# Altium schematic sheet ZET6_原理图.SchDoc
size A3; SheetNumber: 1; SheetTotal: 1
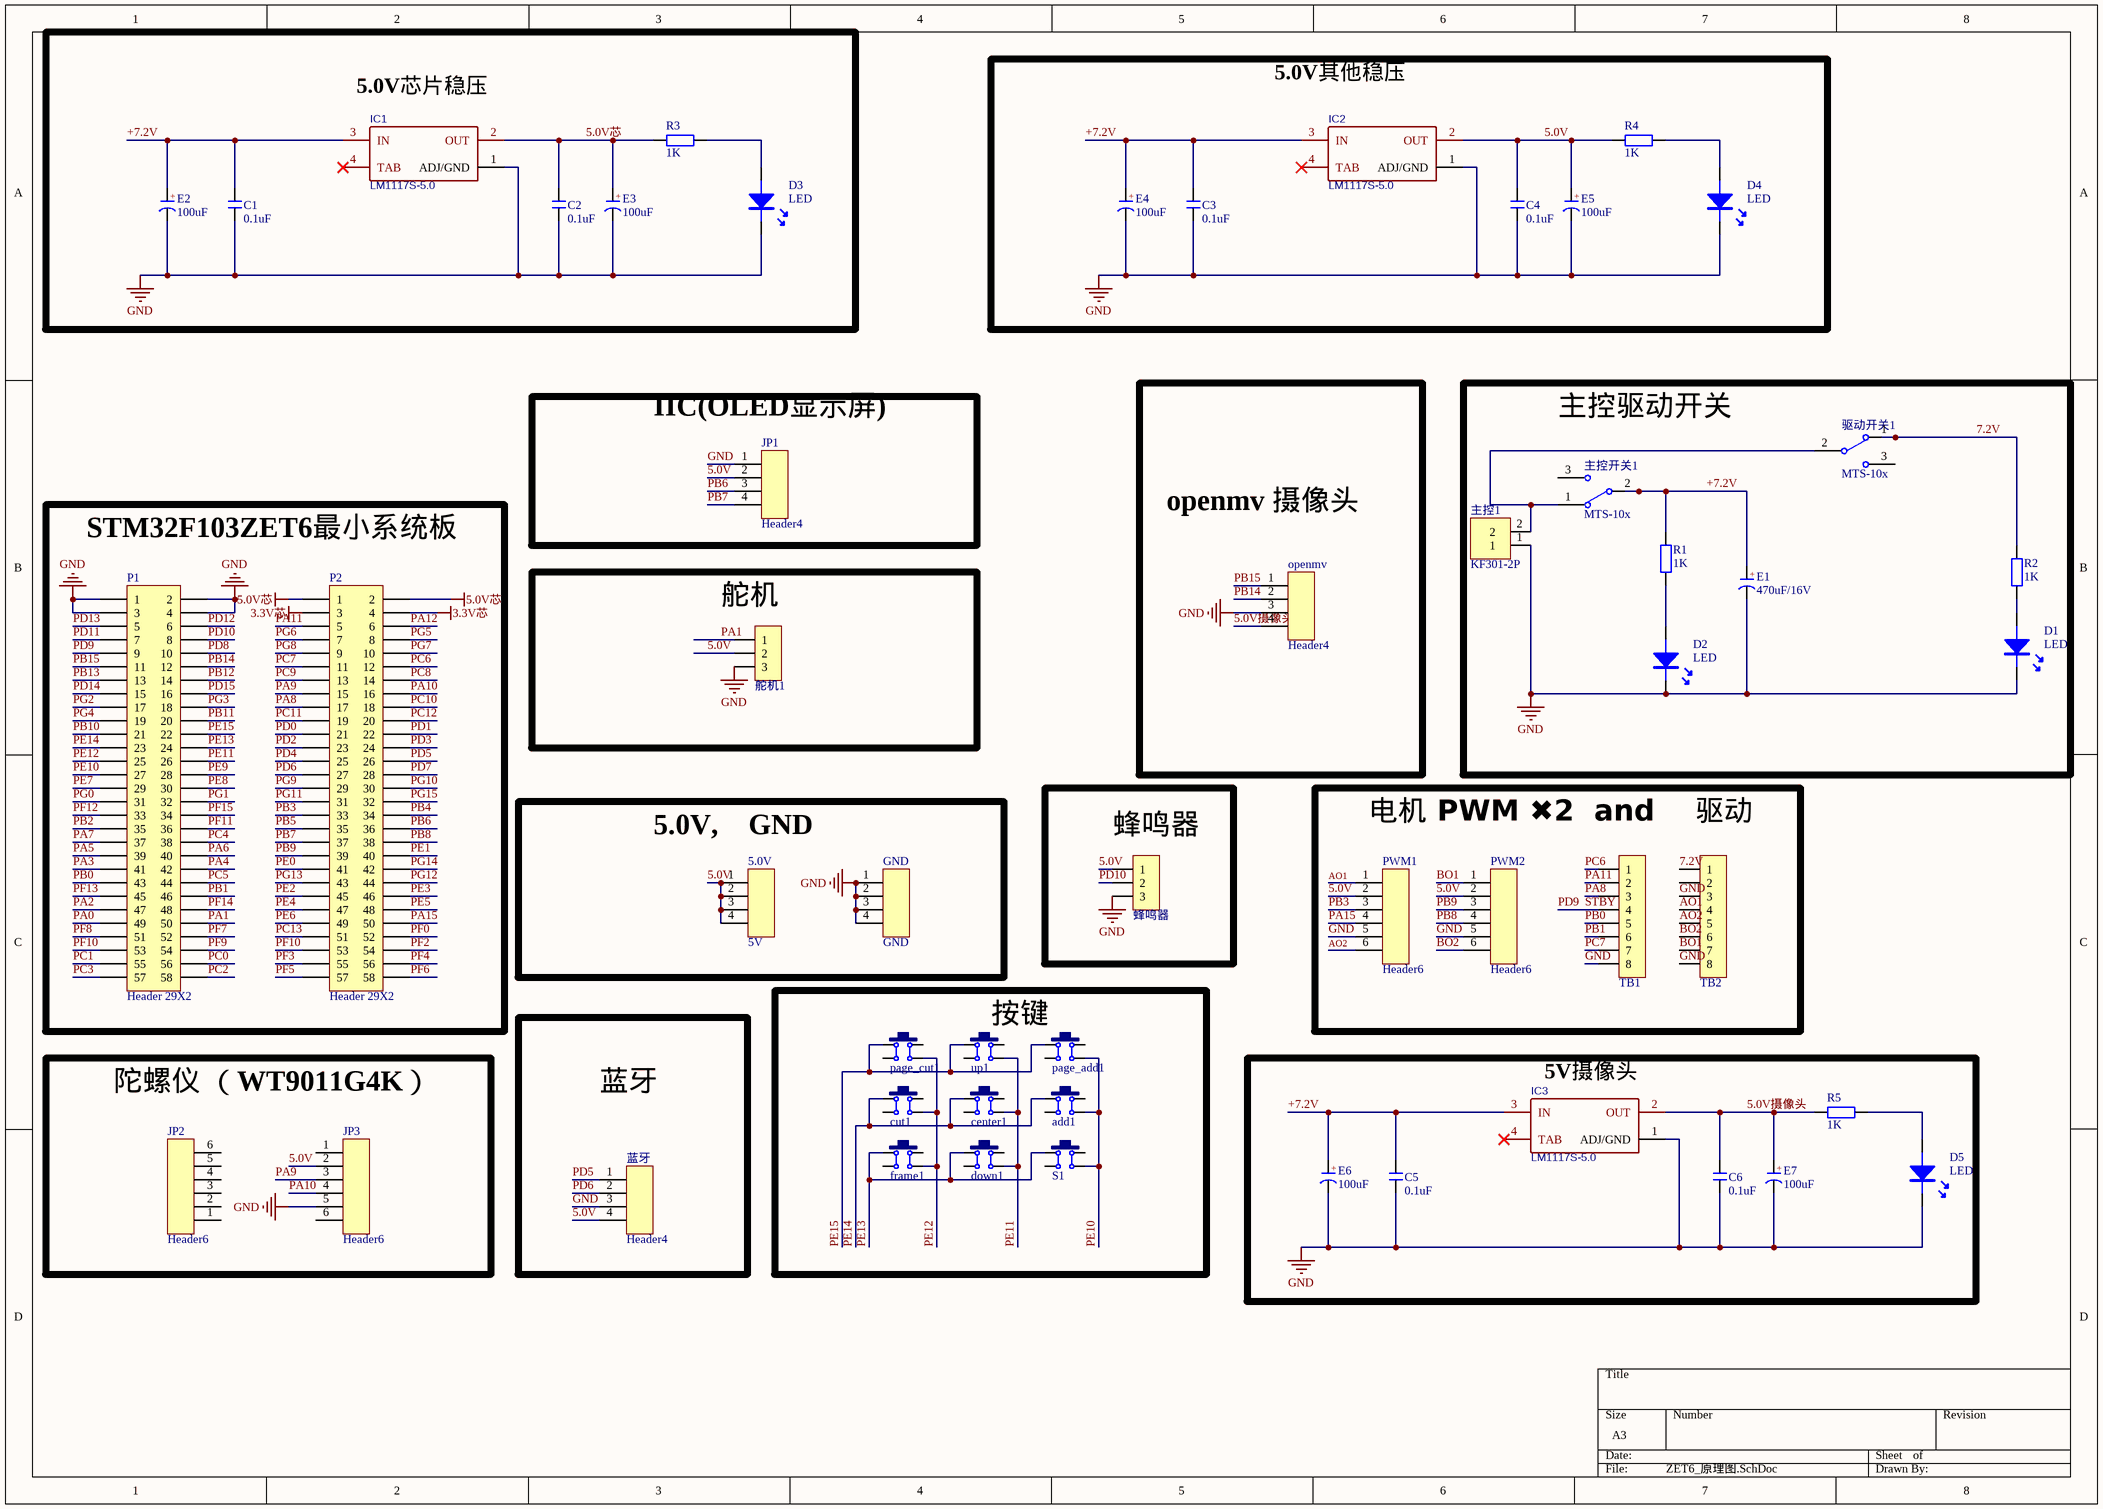
[diagram p0: ZET6_原理图.SchDoc]

## Parts
5.0V  5V  [JP4]
add1  6x6x5  [TSW DIP-6*6*6]  (value not drawn)
C1  0.1uF  [C 0805_M]
C2  0.1uF  [C 0805_M]
C3  0.1uF  [C 0805_M]
C4  0.1uF  [C 0805_M]
C5  0.1uF  [C 0805_M]
C6  0.1uF  [C 0805_M]
center1  6x6x5  [TSW DIP-6*6*6]  (value not drawn)
cut1  6x6x5  [TSW DIP-6*6*6]  (value not drawn)
D1  LED  [LED-0805B]
D2  LED  [LED-0805B]
D3  LED  [LED-0805R]
D4  LED  [LED-0805R]
D5  LED  [LED-0805R]
down1  6x6x5  [TSW DIP-6*6*6]  (value not drawn)
E1  470uF/16V  [CAP 2.5*6.3*11.2 - BK]
E2  100uF  [CD A(3216)]
E3  100uF  [CD A(3216)]
E4  100uF  [CD A(3216)]
E5  100uF  [CD A(3216)]
E6  100uF  [CD A(3216)]
E7  100uF  [CD A(3216)]
frame1  6x6x5  [TSW DIP-6*6*6]  (value not drawn)
GND  GND  [JP4]
IC1  LM1117S-5.0  [SOT-223-3_L6.5-W3.4-P2.30-LS7.0-BR]
IC2  LM1117S-5.0  [SOT-223-3_L6.5-W3.4-P2.30-LS7.0-BR]
IC3  LM1117S-5.0  [SOT-223-3_L6.5-W3.4-P2.30-LS7.0-BR]
JP1  Header4  [JP4]
JP2  Header6  [JP6]
JP3  Header6  [JP6]
openmv  Header4  [JP4]
P1  Header 29X2  [HDR2X29]
P2  Header 29X2  [HDR2X29]
page_add1  6x6x5  [TSW DIP-6*6*6]  (value not drawn)
page_cut1  6x6x5  [TSW DIP-6*6*6]  (value not drawn)
PWM1  Header6  [JP6]
PWM2  Header6  [JP6]
R1  1K  [R 0805_M]
R2  1K  [R 0805_M]
R3  1K  [R 0805_L]
R4  1K  [R 0805_L]
R5  1K  [R 0805_L]
S1  6x6x5  [TSW DIP-6*6*6]  (value not drawn)
TB1  HDR-1X8  [JP8]  (value not drawn)
TB2  HDR-1X8  [JP8]  (value not drawn)
up1  6x6x5  [TSW DIP-6*6*6]  (value not drawn)
主控1  KF301-2P  [KF301-5.0-2P]
主控开关1  MTS-10x  [SS-12D10]
舵机1  HDR-1X3  [jp3]  (value not drawn)
蓝牙  Header4  [JP4]
蜂鸣器  HDR-1X3  [JP3]  (value not drawn)
驱动开关1  MTS-10x  [KFT DIP-7X7]

## Blocks framed on the sheet
5.0V芯片稳压: C1 C2 D3 E2 E3 IC1 R3
5.0V其他稳压: C3 C4 D4 E4 E5 IC2 R4
openmv 摄像头: openmv
主控驱动开关: D1 D2 E1 R1 R2 主控1 主控开关1 驱动开关1
IIC(OLED显示屏): JP1
STM32F103ZET6最小系统板: P1 P2
舵机: 舵机1
5.0V,    GND: 5.0V GND
蜂鸣器: 蜂鸣器
电机 PWM ✖2  and    驱动: PWM1 PWM2 TB1 TB2
按键: add1 center1 cut1 down1 frame1 page_add1 page_cut1 S1 up1
蓝牙: 蓝牙
陀螺仪 （WT9011G4K）: JP2 JP3
5V摄像头: C5 C6 D5 E6 E7 IC3 R5

## Nets
3.3V芯: P2.3 P2.4
5.0V芯: C2.2 E3.1(A) IC1.2(OUT) P2.1 P2.2 R3.1
GND: C1.1 C2.1 C3.1 C4.1 C5.1 C6.1 D1.K D2.K D3.K D4.K D5.K E1.2(K) E2.2(K) E3.2(K) E4.2(K) E5.2(K) E6.2(K) E7.2(K) GND.1 GND.2 GND.3 GND.4 IC1.1(ADJ/GND) IC2.1(ADJ/GND) IC3.1(ADJ/GND) JP1.1 JP3.5 openmv.3 P1.1 P1.2 P1.3 P1.4 PWM1.5 PWM2.5 TB1.8 TB2.3 TB2.8 主控1.1 舵机1.3 蓝牙.3 蜂鸣器.3
5.0V: 5.0V.1 5.0V.2 5.0V.3 5.0V.4 C4.2 E5.1(A) IC2.2(OUT) JP1.2 JP3.2 PWM1.2 PWM2.2 R4.1 舵机1.2 蓝牙.4 蜂鸣器.1
5.0V摄像头: C6.2 E7.1(A) IC3.2(OUT) openmv.4 R5.1
7.2V: R2.2 TB2.1 驱动开关1.1
+7.2V: C1.2 C3.2 C5.2 E1.1(A) E2.1(A) E4.1(A) E6.1(A) IC1.3(IN) IC2.3(IN) IC3.3(IN) R1.2 主控开关1.2
AO1: PWM1.1 TB2.4
AO2: PWM1.6 TB2.5
BO1: PWM2.1 TB2.7
BO2: PWM2.6 TB2.6
PA0: P1.49
PA1: P1.50 舵机1.1
PA2: P1.47
PA3: P1.41
PA4: P1.42
PA5: P1.39
PA6: P1.40
PA7: P1.37
PA8: P2.17 TB1.3
PA9: JP3.3 P2.15
PA10: JP3.4 P2.16
PA11: P2.5 TB1.2
PA12: P2.6
PA15: P2.50 PWM1.4
PB0: P1.43 TB1.5
PB1: P1.46 TB1.6
PB2: P1.35
PB3: P2.33 PWM1.3
PB4: P2.34
PB5: P2.35
PB6: JP1.3 P2.36
PB7: JP1.4 P2.37
PB8: P2.38 PWM2.4
PB9: P2.39 PWM2.3
PB10: P1.21
PB11: P1.20
PB12: P1.14
PB13: P1.13
PB14: openmv.2 P1.12
PB15: openmv.1 P1.11
PC0: P1.56
PC1: P1.55
PC2: P1.58
PC3: P1.57
PC4: P1.38
PC5: P1.44
PC6: P2.12 TB1.1
PC7: P2.11 TB1.7
PC8: P2.14
PC9: P2.13
PC10: P2.18
PC11: P2.19
PC12: P2.20
PC13: P2.51
PD0: P2.21
PD1: P2.22
PD2: P2.23
PD3: P2.24
PD4: P2.25
PD5: P2.26 蓝牙.1
PD6: P2.27 蓝牙.2
PD7: P2.28
PD8: P1.10
PD9: P1.9 TB1.4  [also labelled STBY]
PD10: P1.8 蜂鸣器.2
PD11: P1.7
PD12: P1.6
PD13: P1.5
PD14: P1.15
PD15: P1.16
PE0: P2.41
PE1: P2.40
PE2: P2.45
PE3: P2.46
PE4: P2.47
PE5: P2.48
PE6: P2.49
PE7: P1.29
PE8: P1.30
PE9: P1.28
PE10: add1.3 P1.27 page_add1.3 S1.3
PE11: center1.3 down1.3 P1.26 up1.3
PE12: cut1.3 frame1.3 P1.25 page_cut1.3
PE13: down1.1 frame1.1 P1.24 S1.1
PE14: add1.1 center1.1 cut1.1 P1.23
PE15: P1.22 page_add1.1 page_cut1.1 up1.1
PF0: P2.52
PF2: P2.54
PF3: P2.55
PF4: P2.56
PF5: P2.57
PF6: P2.58
PF7: P1.52
PF8: P1.51
PF9: P1.54
PF10: P1.53 P2.53
PF11: P1.36
PF12: P1.33
PF13: P1.45
PF14: P1.48
PF15: P1.34
PG0: P1.31
PG1: P1.32
PG2: P1.17
PG3: P1.18
PG4: P1.19
PG5: P2.8
PG6: P2.7
PG7: P2.10
PG8: P2.9
PG9: P2.29
PG10: P2.30
PG11: P2.31
PG12: P2.44
PG13: P2.43
PG14: P2.42
PG15: P2.32
NetD1_A: D1.A R2.1
NetD2_A: D2.A R1.1
NetD3_A: D3.A R3.2
NetD4_A: D4.A R4.2
NetD5_A: D5.A R5.2
Net主控1_2: 主控1.2 主控开关1.1 驱动开关1.2

Not connected (* = marked no-connect by the designer): add1 2 4; center1 2 4; cut1 2 4; down1 2 4; frame1 2 4; IC1 4(TAB)*; IC2 4(TAB)*; IC3 4(TAB)*; JP2 1 2 3 4 5 6; JP3 1 6; page_add1 2 4; page_cut1 2 4; S1 2 4; TB2 2; up1 2 4; 主控开关1 3; 驱动开关1 3

## Notes on the sheet
- (in symbol C-CAP) +
- (in symbol C-CD) +

## Library data of the parts
5.0V GND = Header4
add1 center1 cut1 down1 frame1 page_add1 page_cut1 S1 up1 = TSW DIP-6x6: 直插6x6轻触开关; 版权归属: 源创客; BOM名称: 直插6x6轻触开关; 学习资源: www.ooocke.com
C1-C6 = C: 无极性贴片电容; 版权归属: 源创客; BOM名称: 无极性贴片电容; 学习资源: www.ooocke.com
E1 = C-CAP: 直插电解电容; 版权归属: 源创客; BOM名称: 直插电解电容; 学习资源: www.ooocke.com
E2-E7 = C-CD: 贴片钽电容; 版权归属: 源创客; BOM名称: 贴片钽电容; 学习资源: www.ooocke.com
IC1-IC3 = LM1117S-5.0: BOM_Manufacturer: HTC; SMT Type: Extend; BOM_Supplier: LCSC; BOM_Manufacturer Part: LM1117S-5.0; BOM_Supplier Part: C126028; BOM_JLCPCB SMD: Yes; spicePre: U; spiceSymbolName: LM1117S-5.0
R1-R5 = R: 贴片电阻; 版权归属: 源创客; BOM名称: 贴片电阻; 学习资源: www.ooocke.com
TB1 TB2 = Header 8: 8P接插件; 版权归属: 源创客; BOM名称: 8P接插件; 学习资源: www.ooocke.com
主控1 = KF301-2P: KF301插座; pin to pad: 1>2 2>1; 版权所属: go home
主控开关1 驱动开关1 = MTS-10x: MTS10x系列3脚扭子开关; 版权归属: 源创客; BOM名称: MTS10x系列3脚扭子开关; 学习资源: www.ooocke.com
舵机1 蜂鸣器 = Header 3: 3P接插件; 版权归属: 源创客; BOM名称: 3P接插件; 学习资源: www.ooocke.com